# Altium schematic sheet EPS_MPPT_XY_Interface.SchDoc: MPPT-X and MPPT-Y / Interface
size A4; Date: 2015-10-14; SheetNumber: 10; SheetTotal: 51
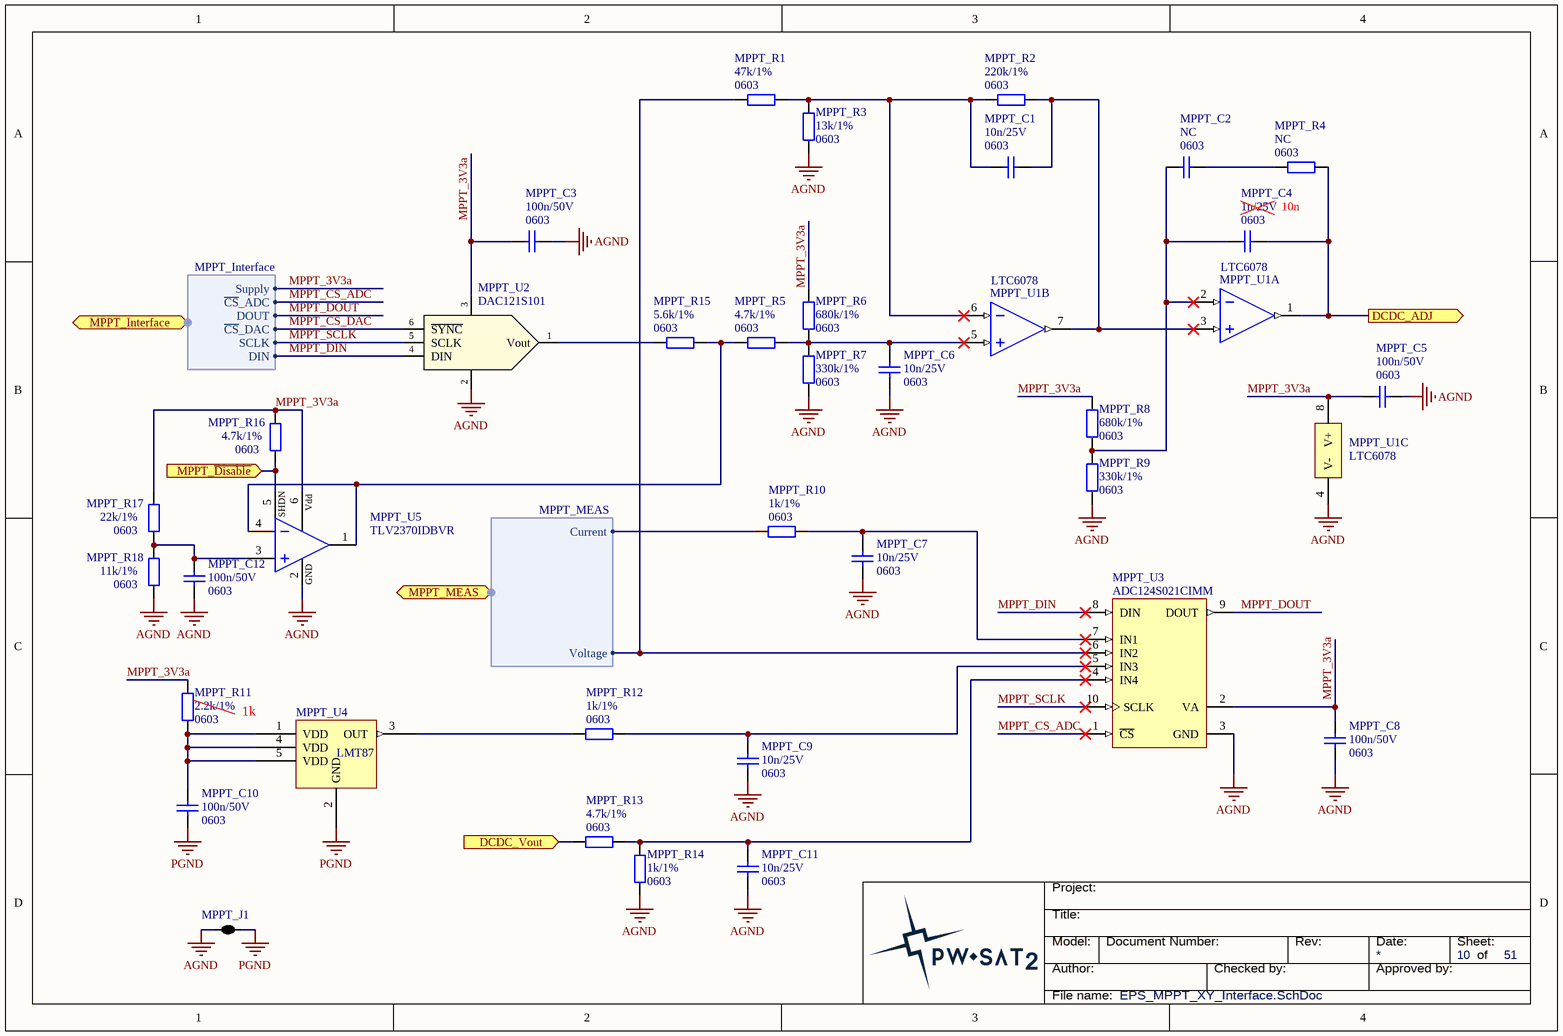
[diagram p0: EPS_MPPT_XY_Interface.SchDoc]

## Parts
MPPT_C1  value 10n/25V  Package: 0603  [SMD_Capacitor_0603]  (hidden comment: Cap)
MPPT_C2  value NC  Package: 0603  [SMD_Capacitor_0603]  (hidden comment: Cap)
MPPT_C3  Package: 0603  [SMD_Capacitor_0603]  (hidden comment: 100n/50V)
MPPT_C4  value 1n/25V  Package: 0603  [SMD_Capacitor_0603]  (hidden comment: Cap)
MPPT_C5  Package: 0603  [SMD_Capacitor_0603]  (hidden comment: 100n/50V)
MPPT_C6  value 10n/25V  Package: 0603  [SMD_Capacitor_0603]  (hidden comment: Cap)
MPPT_C7  value 10n/25V  Package: 0603  [SMD_Capacitor_0603]  (hidden comment: Cap)
MPPT_C8  Package: 0603  [SMD_Capacitor_0603]  (hidden comment: 100n/50V)
MPPT_C9  value 10n/25V  Package: 0603  [SMD_Capacitor_0603]  (hidden comment: Cap)
MPPT_C10  Package: 0603  [SMD_Capacitor_0603]  (hidden comment: 100n/50V)
MPPT_C11  value 10n/25V  Package: 0603  [SMD_Capacitor_0603]  (hidden comment: Cap)
MPPT_C12  value 100n/50V  Package: 0603  [SMD_Capacitor_0603]  (hidden comment: Cap)
MPPT_J1  2 way net tie junction  [2way_LP]  (value not drawn)  (net tie, no BOM)
MPPT_R1  Package: 0603  [SMD_Resistor_0603]  (hidden comment: 47k/1%)
MPPT_R2  Package: 0603  [SMD_Resistor_0603]  (hidden comment: 220k/1%)
MPPT_R3  Package: 0603  [SMD_Resistor_0603]  (hidden comment: 13k/1%)
MPPT_R4  Package: 0603  [SMD_Resistor_0603]  (hidden comment: NC)
MPPT_R5  Package: 0603  [SMD_Resistor_0603]  (hidden comment: 4.7k/1%)
MPPT_R6  Package: 0603  [SMD_Resistor_0603]  (hidden comment: 680k/1%)
MPPT_R7  Package: 0603  [SMD_Resistor_0603]  (hidden comment: 330k/1%)
MPPT_R8  Package: 0603  [SMD_Resistor_0603]  (hidden comment: 680k/1%)
MPPT_R9  Package: 0603  [SMD_Resistor_0603]  (hidden comment: 330k/1%)
MPPT_R10  Package: 0603  [SMD_Resistor_0603]  (hidden comment: 1k/1%)
MPPT_R11  Package: 0603  [SMD_Resistor_0603]  (hidden comment: 2.2k/1%)
MPPT_R12  Package: 0603  [SMD_Resistor_0603]  (hidden comment: 1k/1%)
MPPT_R13  Package: 0603  [SMD_Resistor_0603]  (hidden comment: 4.7k/1%)
MPPT_R14  Package: 0603  [SMD_Resistor_0603]  (hidden comment: 1k/1%)
MPPT_R15  Package: 0603  [SMD_Resistor_0603]  (hidden comment: 5.6k/1%)
MPPT_R16  Package: 0603  [SMD_Resistor_0603]  (hidden comment: 4.7k/1%)
MPPT_R17  Package: 0603  [SMD_Resistor_0603]  (hidden comment: 22k/1%)
MPPT_R18  Package: 0603  [SMD_Resistor_0603]  (hidden comment: 11k/1%)
MPPT_U1  LTC6078  [MSOP-8]  (parts A,B,C of 3)
MPPT_U2  DAC121S101  [SOT23-6]
MPPT_U3  ADC124S021CIMM  [MUB10A_L]
MPPT_U4  LMT87  [SC70-LT5_N]
MPPT_U5  (no value)  [SOT23-6]

## Ports
DCDC_ADJ (out), DCDC_Vout (in), MPPT_Interface (harness MPPT_Interface), MPPT_MEAS (harness MPPT_MEAS), MPPT_~{Disable} (in)

## Harnesses
MPPT_Interface: DIN, DOUT, SCLK, ~{CS}_DAC, ~{CS}_ADC, Supply
MPPT_MEAS: Voltage, Current

## Nets
AGND: MPPT_C3.1 MPPT_C5.2 MPPT_C6.1 MPPT_C7.1 MPPT_C8.2 MPPT_C9.1 MPPT_C11.1 MPPT_C12.1 MPPT_J1.2 MPPT_R3.1 MPPT_R7.1 MPPT_R9.1 MPPT_R14.1 MPPT_R18.2 MPPT_U1.4(V-) MPPT_U2.2(GND) MPPT_U3.3(GND) MPPT_U5.2(GND)
PGND: MPPT_C10.2 MPPT_J1.1 MPPT_U4.2(GND)
DCDC_ADJ: MPPT_C4.2 MPPT_R4.1 MPPT_U1.1(OUT_A) ; port DCDC_ADJ
DCDC_Vout: MPPT_R13.2 ; port DCDC_Vout
MPPT_3V3a: MPPT_C3.2 MPPT_C5.1 MPPT_C8.1 MPPT_R6.2 MPPT_R8.2 MPPT_R11.1 MPPT_R16.1 MPPT_R17.1 MPPT_U1.8(V+) MPPT_U2.3(Va) MPPT_U3.2(VA) MPPT_U5.6(Vdd) ; port MPPT_Interface.Supply
MPPT_CS_ADC: MPPT_U3.1(~{CS}) ; port MPPT_Interface.~{CS}_ADC
MPPT_CS_DAC: MPPT_U2.6(~{SYNC}) ; port MPPT_Interface.~{CS}_DAC
MPPT_~{Disable}: MPPT_R16.2 MPPT_U5.5(SHDN) ; port MPPT_~{Disable}
MPPT_DIN: MPPT_U2.4(DIN) MPPT_U3.8(DIN) ; port MPPT_Interface.DIN
MPPT_DOUT: MPPT_U3.9(DOUT) ; port MPPT_Interface.DOUT
MPPT_SCLK: MPPT_U2.5(SCLK) MPPT_U3.10(SCLK) ; port MPPT_Interface.SCLK
NetMPPT_C1_1: MPPT_C1.1 MPPT_R1.1 MPPT_R2.2 MPPT_R3.2 MPPT_U1.6(IN-_B)
NetMPPT_C1_2: MPPT_C1.2 MPPT_R2.1 MPPT_U1.3(IN+_A) MPPT_U1.7(OUT_B)
NetMPPT_C2_1: MPPT_C2.1 MPPT_C4.1 MPPT_R8.1 MPPT_R9.2 MPPT_U1.2(IN-_A)
NetMPPT_C2_2: MPPT_C2.2 MPPT_R4.2
NetMPPT_C6_2: MPPT_C6.2 MPPT_R5.1 MPPT_R6.1 MPPT_R7.2 MPPT_U1.5(IN+_B)
NetMPPT_C7_2: MPPT_C7.2 MPPT_R10.1 MPPT_U3.7(IN1)
NetMPPT_C9_2: MPPT_C9.2 MPPT_R12.1 MPPT_U3.5(IN3)
NetMPPT_C10_1: MPPT_C10.1 MPPT_R11.2 MPPT_U4.1(VDD) MPPT_U4.4(VDD) MPPT_U4.5(VDD)
NetMPPT_C11_2: MPPT_C11.2 MPPT_R13.1 MPPT_R14.2 MPPT_U3.4(IN4)
NetMPPT_C12_2: MPPT_C12.2 MPPT_R17.2 MPPT_R18.1 MPPT_U5.3(IN+)
NetMPPT_R1_2: MPPT_R1.2 MPPT_U3.6(IN2) ; port MPPT_MEAS.Voltage
NetMPPT_R5_2: MPPT_R5.2 MPPT_R15.1 MPPT_U5.1(OUT) MPPT_U5.4(IN-)
NetMPPT_R10_2: MPPT_R10.2 ; port MPPT_MEAS.Current
NetMPPT_R12_2: MPPT_R12.2 MPPT_U4.3(OUT)
NetMPPT_R15_2: MPPT_R15.2 MPPT_U2.1(Vout)

## Notes on the sheet
- 10n
- 1k
- Title:
- Project:
- Author:
- Model:
- Document Number:
- Checked by:
- Rev:
- Date:
- Approved by:
- Sheet:
- of
- File name:

## Library data of the parts
MPPT_C3 MPPT_C5 MPPT_C8 MPPT_C10 = Cer_C0603T104K5RALTU: Ceramic Cap Kemet COTS 100n/50V X7R 0603; Manufacturer: Kemet; ManufacturerPartNumber: C0603T104K5RALTU; Value: 100n/50V
MPPT_J1 = 2way: ComponentLink1URL: http://www.edatools.cz/addons; ComponentLink1Description: Source; FootprintNote: LP=12mil, MP=40mil, HP=120mil
MPPT_R1-MPPT_R15 = Res
  MPPT_R1: Value: 47k/1%
  MPPT_R2: Value: 220k/1%
  MPPT_R3: Value: 13k/1%
  MPPT_R4: Value: NC
  MPPT_R5 MPPT_R13: Value: 4.7k/1%
  MPPT_R6 MPPT_R8: Value: 680k/1%
  MPPT_R7 MPPT_R9: Value: 330k/1%
  MPPT_R10 MPPT_R12 MPPT_R14: Value: 1k/1%
  MPPT_R11: Value: 2.2k/1%
  MPPT_R15: Value: 5.6k/1%
MPPT_R16-MPPT_R18 = CRCW06034K70FKxxxx: 4.7k/1% Vishay CRCW 0603 Resistor. 100mW, 100ppm, 75V.; Manufacturer: Vishay; ManufactuerPartNumber: CRCW06034K70FKxxxx
  MPPT_R16: Value: 4.7k/1%
  MPPT_R17: Value: 22k/1%
  MPPT_R18: Value: 11k/1%
MPPT_U1 = LTC6078: Rail-to-rail, quad operational amplifier. Library compatible with LTC608X LTC607X op-amps; Manufacturer: Linear Technology; Value: LTC6078
MPPT_U2 = DAC121S101: 12-Bit Micro Power, RRO Digital-to-Analog Converter.; Manufacturer: Texas Instruments; Value: DAC121S101
MPPT_U3 = ADC124S021CIMM/NOPB: Manufacturer: Texas Instruments; ManufacturerPartNumber: ADC124S021CIMM/NOPB; Value: ADC124S021CIMM
MPPT_U4 = LMT87: Analog Temperature Sensors with Class-AB Output
MPPT_U5 = TLV2370IDBVR: 3-MHz Rail-to-Rail In/Out Single Operational Amplifier; Manufacturer: Texas Instruments; HelpUrl: http://www.ti.com/lit/ds/symlink/tlv2370.pdf; ManufacturerPartNumber: TLV2370IDBVR